# EAGLE design session 8 (EAGLE 9.6.2)
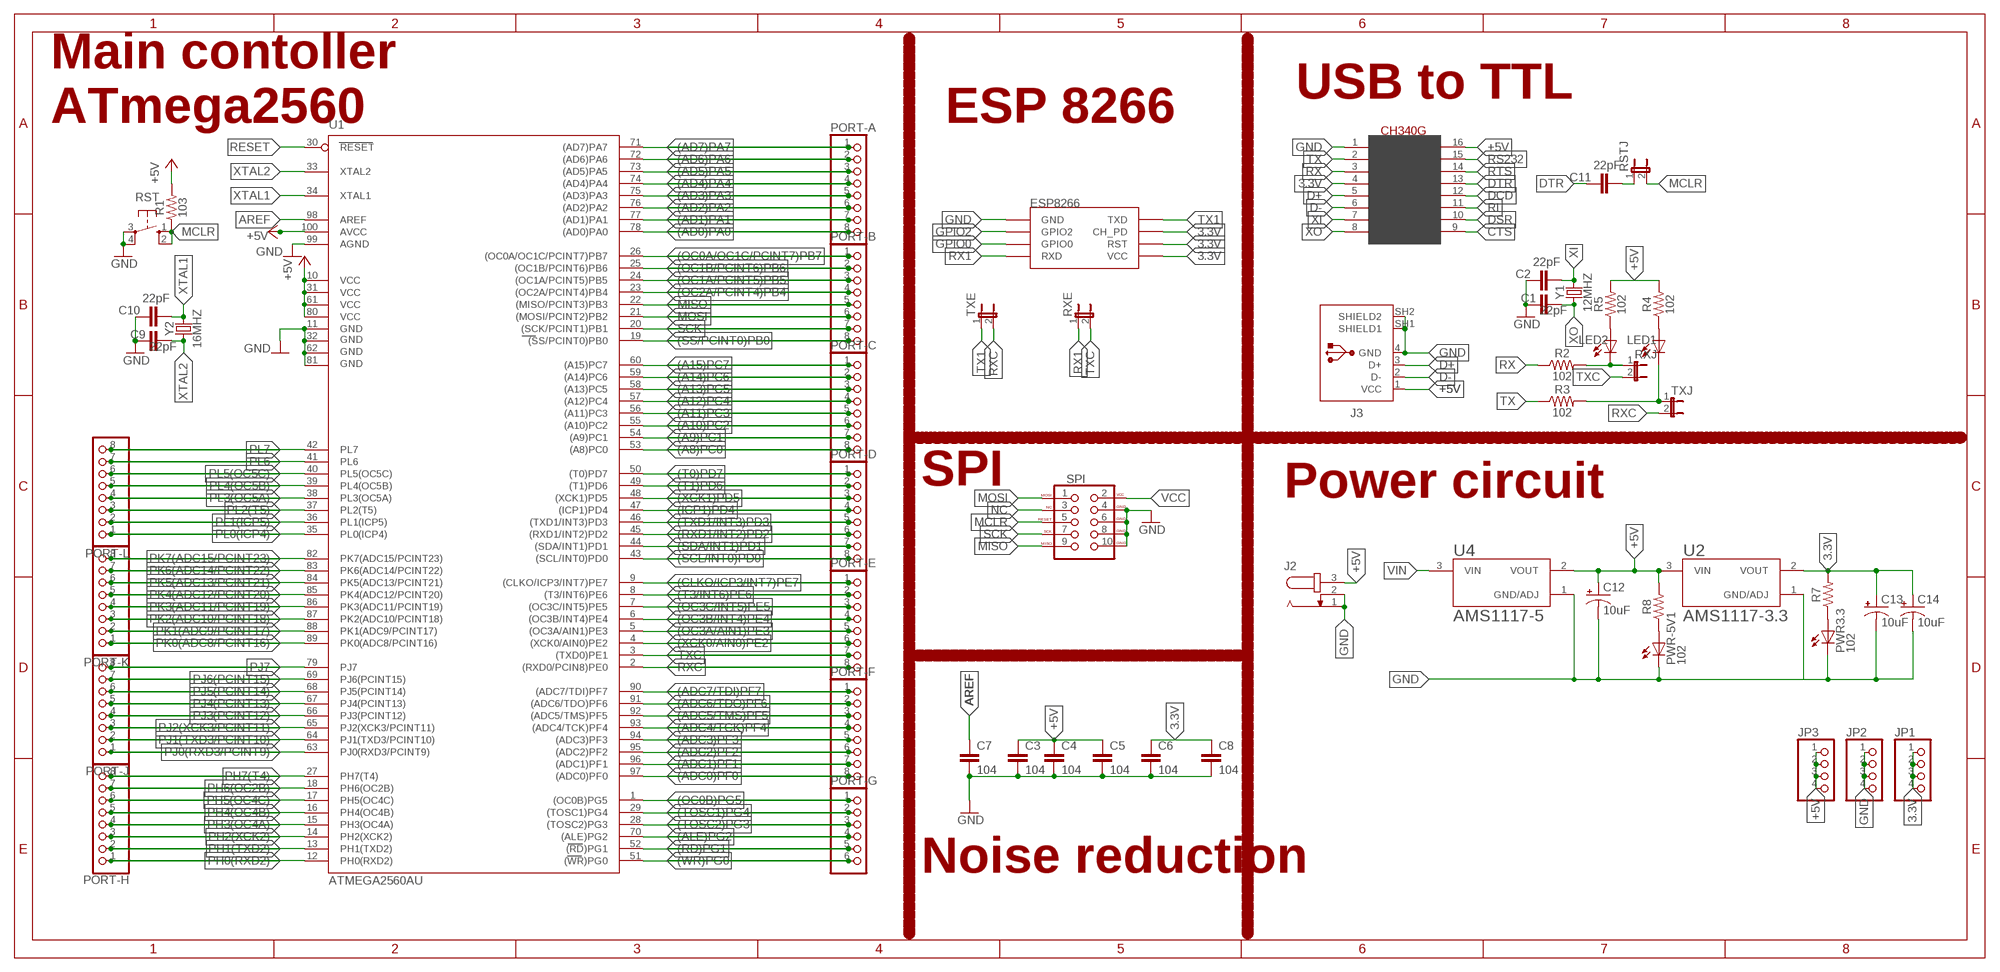
[diagram p0: schematic, sheet 1]

## Parts
C1  22pF  22PF-PTH-2.54MM-200V-5%  [CAP-PTH-2.54]
C2  22pF  22PF-PTH-2.54MM-200V-5%  [CAP-PTH-2.54]
C3  104  0.1UF-KIT-EZ-50V-20%  [CAP-PTH-SMALL-KIT]
C4  104  0.1UF-KIT-EZ-50V-20%  [CAP-PTH-SMALL-KIT]
C5  104  0.1UF-KIT-EZ-50V-20%  [CAP-PTH-SMALL-KIT]
C6  104  0.1UF-KIT-EZ-50V-20%  [CAP-PTH-SMALL-KIT]
C7  104  0.1UF-KIT-EZ-50V-20%  [CAP-PTH-SMALL-KIT]
C8  104  0.1UF-KIT-EZ-50V-20%  [CAP-PTH-SMALL-KIT]
C9  22pF  22PF-PTH-2.54MM-200V-5%  [CAP-PTH-2.54]
C10  22pF  22PF-PTH-2.54MM-200V-5%  [CAP-PTH-2.54]
C11  22pF  22PF-PTH-2.54MM-200V-5%  [CAP-PTH-2.54]
C12  10uF  10UF-POLAR-RADIAL-2.5MM-25V-20%  [CPOL-RADIAL-2.5MM-5MM]
C13  10uF  10UF-POLAR-RADIAL-2.5MM-25V-20%  [CPOL-RADIAL-2.5MM-5MM]
C14  10uF  10UF-POLAR-RADIAL-2.5MM-25V-20%  [CPOL-RADIAL-2.5MM-5MM]
ESP8266  ESP01  [ESP01]
J2  JACK-PLUG1  [SPC4078]
J3  61729-1011  [61729-1011BLF]
JP1  PINHD-1X4  [1X04]
JP2  PINHD-1X4  [1X04]
JP3  PINHD-1X4  [1X04]
LED1  LEDCHIP-LED0805  [CHIP-LED0805]
LED2  LEDCHIP-LED0805  [CHIP-LED0805]
PORT-A  PINHD-1X8  [1X08]
PORT-B  PINHD-1X8  [1X08]
PORT-C  PINHD-1X8  [1X08]
PORT-D  PINHD-1X8  [1X08]
PORT-E  PINHD-1X8  [1X08]
PORT-F  PINHD-1X8  [1X08]
PORT-G  PINHD-1X6  [1X06]
PORT-H  PINHD-1X8  [1X08]
PORT-J  PINHD-1X8  [1X08]
PORT-K  PINHD-1X8  [1X08]
PORT-L  PINHD-1X8  [1X08]
PWR3.3  102  LEDCHIP-LED0805  [CHIP-LED0805]
PWR-5V1  102  LEDCHIP-LED0805  [CHIP-LED0805]
R1  103  RESISTOR1206  [1206]
R2  102  RESISTOR1206  [1206]
R3  102  RESISTOR1206  [1206]
R4  102  RESISTOR1206  [1206]
R5  102  RESISTOR1206  [1206]
R7  RESISTOR1206  [1206]
R8  RESISTOR1206  [1206]
RST  10-XX  [B3F-10XX]
RSTJ  JP1E  [JP1]
RXE  JP1E  [JP1]
RXJ  JP1E  [JP1]
SPI  AVR_SPI_PROG_5X2LOCK  [2X5-SHROUDED_LOCK]
TXE  JP1E  [JP1]
TXJ  JP1E  [JP1]
U1  ATMEGA2560AU  [TQFP100]
U2  AMS1117-3.3  [SOT229P700X180-4N]
U4  AMS1117-5  AMS1117-3.3  [SOT229P700X180-4N]
U$2  CH340G  [SOIC16]
Y1  12MHZ  CRYSTALPTH-HC49UV  [HC49U]
Y2  16MHZ  CRYSTALPTH-HC49UV  [HC49U]

## Nets
3.3V: C6.1 C8.1 C13.1(+) C14.1(+) ESP8266.CH_PD ESP8266.RST ESP8266.VCC JP1.1 JP1.2 JP1.3 JP1.4 R7.2 U2.2(VOUT) U$2.4(V3)
(A8)PC0: PORT-C.8 U1.53((A8)PC0)
(A9)PC1: PORT-C.7 U1.54((A9)PC1)
(A10)PC2: PORT-C.6 U1.55((A10)PC2)
(A11)PC3: PORT-C.5 U1.56((A11)PC3)
(A12)PC4: PORT-C.4 U1.57((A12)PC4)
(A13)PC5: PORT-C.3 U1.58((A13)PC5)
(A14)PC6: PORT-C.2 U1.59((A14)PC6)
(A15)PC7: PORT-C.1 U1.60((A15)PC7)
(AD0)PA0: PORT-A.8 U1.78((AD0)PA0)
(AD1)PA1: PORT-A.7 U1.77((AD1)PA1)
(AD2)PA2: PORT-A.6 U1.76((AD2)PA2)
(AD3)PA3: PORT-A.5 U1.75((AD3)PA3)
(AD4)PA4: PORT-A.4 U1.74((AD4)PA4)
(AD5)PA5: PORT-A.3 U1.73((AD5)PA5)
(AD6)PA6: PORT-A.2 U1.72((AD6)PA6)
(AD7)PA7: PORT-A.1 U1.71((AD7)PA7)
(ADC0)PF0: PORT-F.8 U1.97((ADC0)PF0)
(ADC1)PF1: PORT-F.7 U1.96((ADC1)PF1)
(ADC2)PF2: PORT-F.6 U1.95((ADC2)PF2)
(ADC3)PF3: PORT-F.5 U1.94((ADC3)PF3)
(ADC4/TCK)PF4: PORT-F.4 U1.93((ADC4/TCK)PF4)
(ADC5/TMS)PF5: PORT-F.3 U1.92((ADC5/TMS)PF5)
(ADC6/TDO)PF6: PORT-F.2 U1.91((ADC6/TDO)PF6)
(ADC7/TDI)PF7: PORT-F.1 U1.90((ADC7/TDI)PF7)
(ALE)PG2: PORT-G.4 U1.70((ALE)PG2)
(CLKO/ICP3/INT7)PE7: PORT-E.1 U1.9((CLKO/ICP3/INT7)PE7)
(ICP1)PD4: PORT-D.4 U1.47((ICP1)PD4)
(OC0A/OC1C/PCINT7)PB7: PORT-B.1 U1.26((OC0A/OC1C/PCINT7)PB7)
(OC0B)PG5: PORT-G.1 U1.1((OC0B)PG5)
(OC1A/PCINT5)PB5: PORT-B.3 U1.24((OC1A/PCINT5)PB5)
(OC1B/PCINT6)PB6: PORT-B.2 U1.25((OC1B/PCINT6)PB6)
(OC2A/PCINT4)PB4: PORT-B.4 U1.23((OC2A/PCINT4)PB4)
(OC3A/AIN1)PE3: PORT-E.5 U1.5((OC3A/AIN1)PE3)
(OC3B/INT4)PE4: PORT-E.4 U1.6((OC3B/INT4)PE4)
(OC3C/INT5)PE5: PORT-E.3 U1.7((OC3C/INT5)PE5)
(RD)PG1: PORT-G.5 U1.52((RD)PG1)
(RXD1/INT2)PD2: PORT-D.6 U1.45((RXD1/INT2)PD2)
(SCL/INT0)PD0: PORT-D.8 U1.43((SCL/INT0)PD0)
(SDA/INT1)PD1: PORT-D.7 U1.44((SDA/INT1)PD1)
(SS/PCINT0)PB0: PORT-B.8 U1.19((SS/PCINT0)PB0)
(T0)PD7: PORT-D.1 U1.50((T0)PD7)
(T1)PD6: PORT-D.2 U1.49((T1)PD6)
(T3/INT6)PE6: PORT-E.2 U1.8((T3/INT6)PE6)
(TOSC1)PG4: PORT-G.2 U1.29((TOSC1)PG4)
(TOSC2)PG3: PORT-G.3 U1.28((TOSC2)PG3)
(TXD1/INT3)PD3: PORT-D.5 U1.46((TXD1/INT3)PD3)
(WR)PG0: PORT-G.6 U1.51((WR)PG0)
(XCK0/AIN0)PE2: PORT-E.6 U1.4((XCK0/AIN0)PE2)
(XCK1)PD5: PORT-D.3 U1.48((XCK1)PD5)
+5V: C3.1 C4.1 C5.1 C12.1(+) J2.3 J3.1(VCC) JP3.1 JP3.2 JP3.3 JP3.4 R1.2 R4.2 R5.2 R8.2 U1.10(VCC) U1.31(VCC1) U1.61(VCC2) U1.80(VCC3) U1.100(AVCC) U2.3(VIN) U4.2(VOUT) U$2.16(VCC)
AREF: C7.1 U1.98(AREF)
CTS: U$2.9(CTS)
D+: J3.3(D+) U$2.5(D+)
D-: J3.2(D-) U$2.6(D-)
DCD: U$2.12(DCD)
DSR: U$2.10(DSR)
DTR: C11.1 U$2.13(DTR)
GND: C1.1 C2.1 C3.2 C4.2 C5.2 C6.2 C7.2 C8.2 C9.1 C10.1 C12.2(-) C13.2(-) C14.2(-) ESP8266.GND J2.1 J2.2 J3.4(GND) J3.SH1(SHIELD1) J3.SH2(SHIELD2) JP2.1 JP2.2 JP2.3 JP2.4 PWR3.3.C PWR-5V1.C RST.3(P) RST.4(P1) SPI.4(GND) SPI.6(GND) SPI.8(GND) SPI.10(GND) U1.11(GND) U1.32(GND1) U1.62(GND2) U1.81(GND3) U1.99(AGND) U2.1(GND/ADJ) U4.1(GND/ADJ) U$2.1(GND)
GPIO0: ESP8266.GPIO0
GPIO2: ESP8266.GPIO2
MCLR: R1.1 RST.1(S) RST.2(S1) RSTJ.2 SPI.5(RESET)
MISO: PORT-B.5 SPI.9(MISO) U1.22((MISO/PCINT3)PB3)
MOSI: PORT-B.6 SPI.1(MOSI) U1.21((MOSI/PCINT2)PB2)
N$1: LED1.A R4.1
N$2: C11.2 RSTJ.1
N$3: LED2.A R5.1
N$5: PWR3.3.A R7.1
N$6: PWR-5V1.A R8.1
NC: SPI.3(NC)
PH0(RXD2): PORT-H.1 U1.12(PH0(RXD2))
PH1(TXD2): PORT-H.2 U1.13(PH1(TXD2))
PH2(XCK2): PORT-H.3 U1.14(PH2(XCK2))
PH3(OC4A): PORT-H.4 U1.15(PH3(OC4A))
PH4(OC4B): PORT-H.5 U1.16(PH4(OC4B))
PH5(OC4C): PORT-H.6 U1.17(PH5(OC4C))
PH6(OC2B): PORT-H.7 U1.18(PH6(OC2B))
PH7(T4): PORT-H.8 U1.27(PH7(T4))
PJ0(RXD3/PCINT9): PORT-J.1 U1.63(PJ0(RXD3/PCINT9))
PJ1(TXD3/PCINT10): PORT-J.2 U1.64(PJ1(TXD3/PCINT10))
PJ2(XCK3/PCINT11): PORT-J.3 U1.65(PJ2(XCK3/PCINT11))
PJ3(PCINT12): PORT-J.4 U1.66(PJ3(PCINT12))
PJ4(PCINT13): PORT-J.5 U1.67(PJ4(PCINT13))
PJ5(PCINT14): PORT-J.6 U1.68(PJ5(PCINT14))
PJ6(PCINT15): PORT-J.7 U1.69(PJ6(PCINT15))
PJ7: PORT-J.8 U1.79(PJ7)
PK0(ADC8/PCINT16): PORT-K.1 U1.89(PK0(ADC8/PCINT16))
PK1(ADC9/PCINT17): PORT-K.2 U1.88(PK1(ADC9/PCINT17))
PK2(ADC10/PCINT18): PORT-K.3 U1.87(PK2(ADC10/PCINT18))
PK3(ADC11/PCINT19): PORT-K.4 U1.86(PK3(ADC11/PCINT19))
PK4(ADC12/PCINT20): PORT-K.5 U1.85(PK4(ADC12/PCINT20))
PK5(ADC13/PCINT21): PORT-K.6 U1.84(PK5(ADC13/PCINT21))
PK6(ADC14/PCINT22): PORT-K.7 U1.83(PK6(ADC14/PCINT22))
PK7(ADC15/PCINT23): PORT-K.8 U1.82(PK7(ADC15/PCINT23))
PL0(ICP4): PORT-L.1 U1.35(PL0(ICP4))
PL1(ICP5): PORT-L.2 U1.36(PL1(ICP5))
PL2(T5): PORT-L.3 U1.37(PL2(T5))
PL3(OC5A): PORT-L.4 U1.38(PL3(OC5A))
PL4(OC5B): PORT-L.5 U1.39(PL4(OC5B))
PL5(OC5C): PORT-L.6 U1.40(PL5(OC5C))
PL6: PORT-L.7 U1.41(PL6)
PL7: PORT-L.8 U1.42(PL7)
RESET: U1.30(RESET)
RI: U$2.11(RI)
RS232: U$2.15(RS232)
RTS: U$2.14(RTS)
RX: R2.1 U$2.3(RX)
RX0: LED1.C R3.2 TXJ.1
RX1: ESP8266.RX(RXD) RXE.1
RXC: PORT-E.8 TXE.2 TXJ.2 U1.2((RXD0/PCIN8)PE0)
SCK: PORT-B.7 SPI.7(SCK) U1.20((SCK/PCINT1)PB1)
TX: R3.1 U$2.2(TX)
TX0: LED2.C R2.2 RXJ.1
TX1: ESP8266.TX(TXD) TXE.1
TXC: PORT-E.7 RXE.2 RXJ.2 U1.3((TXD0)PE1)
VCC: SPI.2(VCC)
VIN: U4.3(VIN)
XI: C2.2 U$2.7(XI) Y1.2
XO: C1.2 U$2.8(XO) Y1.1
XTAL1: C10.2 U1.34(XTAL1) Y2.2
XTAL2: C9.2 U1.33(XTAL2) Y2.1

## Notes on the sheet
- USB to TTL
- Main contoller 
  ATmega2560
- ESP 8266
- SPI | Power circuit
- Noise reduction

## Library data of the parts
C1 C2 C9-C11 = SparkFun-Capacitors:22PF: 22pF ceramic capacitors A capacitor is a passive two-terminal electrical component used to store electrical energy temporarily in an electric field.; PROD_ID: CAP-09128
C3-C8 = SparkFun-Capacitors:0.1UF: 0.1µF ceramic capacitors A capacitor is a passive two-terminal electrical component used to store electrical energy temporarily in an electric field.; PROD_ID: CAP-08370; VALUE: 0.1uF
C12-C14 = SparkFun-Capacitors:10UF-POLAR: 10.0µF polarized capacitors A capacitor is a passive two-terminal electrical component used to store electrical energy temporarily in an electric field.; PROD_ID: CAP-08440
ESP8266 = esp8266modules:ESP01: ESP8266 Wifi module 01
J2 = con-jack:JACK-PLUG: DC POWER JACK Power Jack, DC, Right Angle, Through Hole, Rated 5A at 16VDC, PC Terminals Distributor: Farnell (www.Farnell.de) Drawing: 84N1161.pdf / 84N1162.pdf Manufacturer: SPC Technology (www.spctechnology.com) Type: SPC4077 / SPC 4078; OC_FARNELL: unknown; OC_NEWARK: unknown
J3 = Connector_USB:61729-1011: USB(2.0) Type-B, RCPT, 4POS, THT-R/A Datasheet <https://www.amphenol-icc.com/media/wysiwyg/files/drawing/61729.pdf>; CATEGORY: Connector; CONTACTS: 4; CURRENT_RATING: 1A; DESCRIPTION: CONN RCPT USB2.0 TYPEB 4POS R/A; GENDER: Receptacle; MANUFACTURER: Amphenol ICC (FCI); MOUNT_TYPE: R/A; MPN: 61729-1011BLF; OPERATING_TEMP: -55°C to 85°C; PART_STATUS: Active; ROHS_COMPLIANT: RoHS Compliant; SERIES: 61729; SUB-CATEGORY: USB; TYPE: USB-B
JP1-JP3 = pinhead:PINHD-1X4: PIN HEADER
LED1 LED2 PWR3.3 PWR-5V1 = Fidget Spinner Example:LED: LED OSRAM: - CHIPLED LG R971, LG N971, LY N971, LG Q971, LY Q971, LO R971, LY R971 LH N974, LH R974 LS Q976, LO Q976, LY Q976 LO Q996 - Hyper CHIPLED LW Q18S LB Q993, LB Q99A, LB R99A - SideLED LS A670, LO A670, LY A670, LG A670, LP A670 LB A673, LV A673, LT A673, LW A673 LH A674 LY A675 LS A676, LA A676, LO A676, LY A676, LW A676 LS A679, LY A679, LG A679 - Hyper Micro SIDELED® LS Y876, LA Y876, LO Y876, LY Y876 LT Y87S - SmartLED LW L88C, LW L88S LB L89C, LB L89S, LG L890 LS L89K, LO L89K, LY L89K LS L896, LA L896, LO L896, LY L896 - TOPLED LS T670, LO T670, LY T670, LG T670, LP T670 LSG T670, LSP T670, LSY T670, LOP T670, LYG T670 LG T671, LOG T671, LSG T671 LB T673, LV T673, LT T673, LW T673 LH T674 LS T676, LA T676, LO T676, LY T676, LB T676, LH T676, LSB T676, LW T676 LB T67C, LV T67C, LT T67C, LS T67K, LO T67K, LY T67K, LW E67C LS E67B, LA E67B, LO E67B, LY E67B, LB E67C, LV E67C, LT E67C LW T67C LS T679, LY T679, LG T679 LS T770, LO T770, LY T770, LG T770, LP T770 LB T773, LV T773, LT T773, LW T773 LH T774 LS E675, LA E675, LY E675, LS T675 LS T776, LA T776, LO T776, LY T776, LB T776 LHGB T686 LT T68C, LB T68C - Hyper Mini TOPLED® LB M676 - Mini TOPLED Santana® LG M470 LS M47K, LO M47K, LY M47K Source: http://www.osram.convergy.de LUXEON: - LUMILED® LXK2-PW12-R00, LXK2-PW12-S00, LXK2-PW14-U00, LXK2-PW14-V00 LXK2-PM12-R00, LXK2-PM12-S00, LXK2-PM14-U00 LXK2-PE12-Q00, LXK2-PE12-R00, LXK2-PE12-S00, LXK2-PE14-T00, LXK2-PE14-U00 LXK2-PB12-K00, LXK2-PB12-L00, LXK2-PB12-M00, LXK2-PB14-N00, LXK2-PB14-P00, LXK2-PB14-Q00 LXK2-PR12-L00, LXK2-PR12-M00, LXK2-PR14-Q00, LXK2-PR14-R00 LXK2-PD12-Q00, LXK2-PD12-R00, LXK2-PD12-S00 LXK2-PH12-R00, LXK2-PH12-S00 LXK2-PL12-P00, LXK2-PL12-Q00, LXK2-PL12-R00 Source: www.luxeon.com KINGBRIGHT: KA-3528ASYC Source: www.kingbright.com
PORT-A PORT-B PORT-C PORT-D PORT-E PORT-F PORT-H PORT-J PORT-K PORT-L = pinhead:PINHD-1X8: PIN HEADER
PORT-G = pinhead:PINHD-1X6: PIN HEADER
R1-R5 R7 R8 = SparkFun-Resistors:RESISTOR: Generic Resistor Package
RST = switch-omron:10-XX: OMRON SWITCH; MPN: B3F-1000; OC_FARNELL: 176432; OC_NEWARK: 36M3542
RSTJ RXE RXJ TXE TXJ = jumper:JP1E: JUMPER
SPI = SparkFun-Connectors:AVR_SPI_PROG_5X2: AVR 10-pin ICSP Header This is the standard AVR In Circuit Serial Programming header. Minimal, but includes pin one indicator. Works with standard Olimex programmers. SparkFun Products: 2x5 AVR ICSP Male Header <https://www.sparkfun.com/products/778> - PTH 2x5 Pin Shrouded Header <https://www.sparkfun.com/products/8506> - PTH2; PROD_ID: CONN-08671; SF_ID: PRT-08506
U1 = SparkFun-IC-Microcontroller:ATMEGA2560: Atmel 100-pin 8-bit uC 64/128/256 Kbytes FLASH 4 Kbytes EEPROM 8 Kbytes SRAM 86 General Purpose I/O pins 12-channels16-bit PWM 4 x Serial USARTs 16-channels 10-bit A/D SparkFun Products None.; PROD_ID: IC-10040
U2 U4 = AMS1117-3.3:AMS1117-3.3: Check availability <https://pricing.snapeda.com/parts/AMS1117-3.3/Advanced%20Monolithic%20Systems/view-part?ref=eda>; AVAILABILITY: Not in stock; DESCRIPTION: Sot223/Pkg 1-Amp 3.3-Volt Low Drop Out Voltage Regulatator; MF: Advanced Monolithic Systems; MP: AMS1117-3.3; PACKAGE: SOT-223 Seeed Technology; PRICE: None
U$2 = CH340G (1):CH340G: Check availability <https://pricing.snapeda.com/parts/CH340G/Olimex/view-part?ref=eda>; AVAILABILITY: Not in stock; DESCRIPTION: IC-340 USB INTERFACE SO16; MF: Olimex; MP: CH340G; PACKAGE: None; PRICE: None
Y1 Y2 = SparkFun-Clocks:CRYSTAL: Crystals (Generic) These are passive quartz crystals, which can be used as a clock source for a microcontroller. Crystal's are two-terminal devices. They require external "load" capacitors to generate an oscillating signal.

## Board
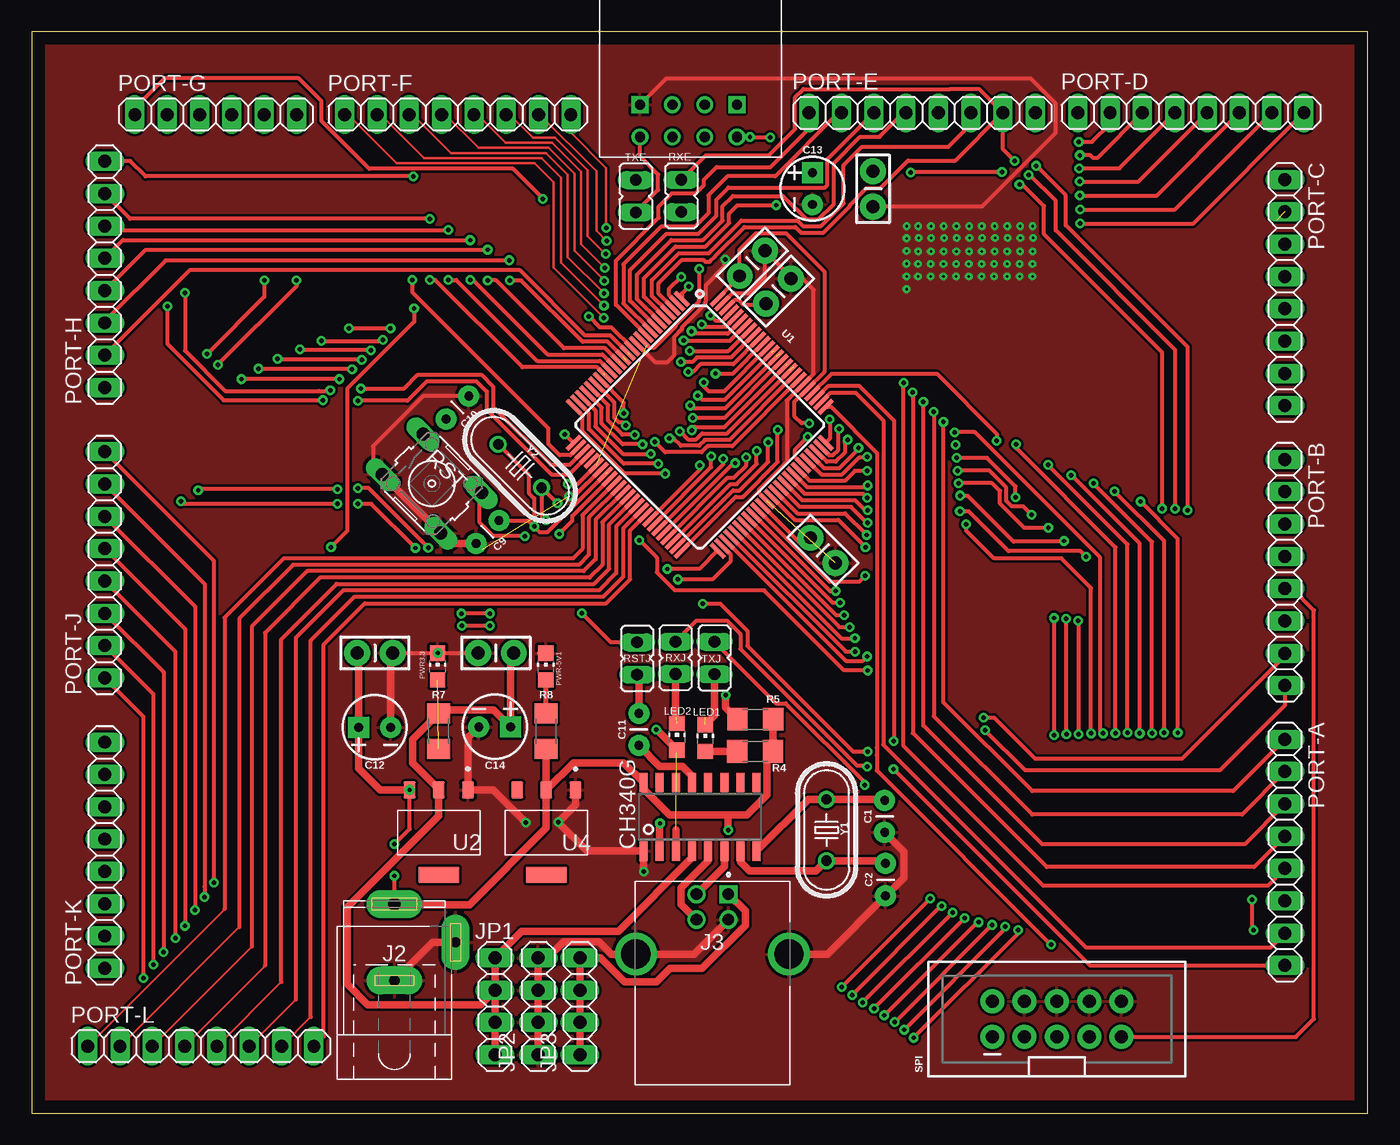
[diagram p1: board, top side]
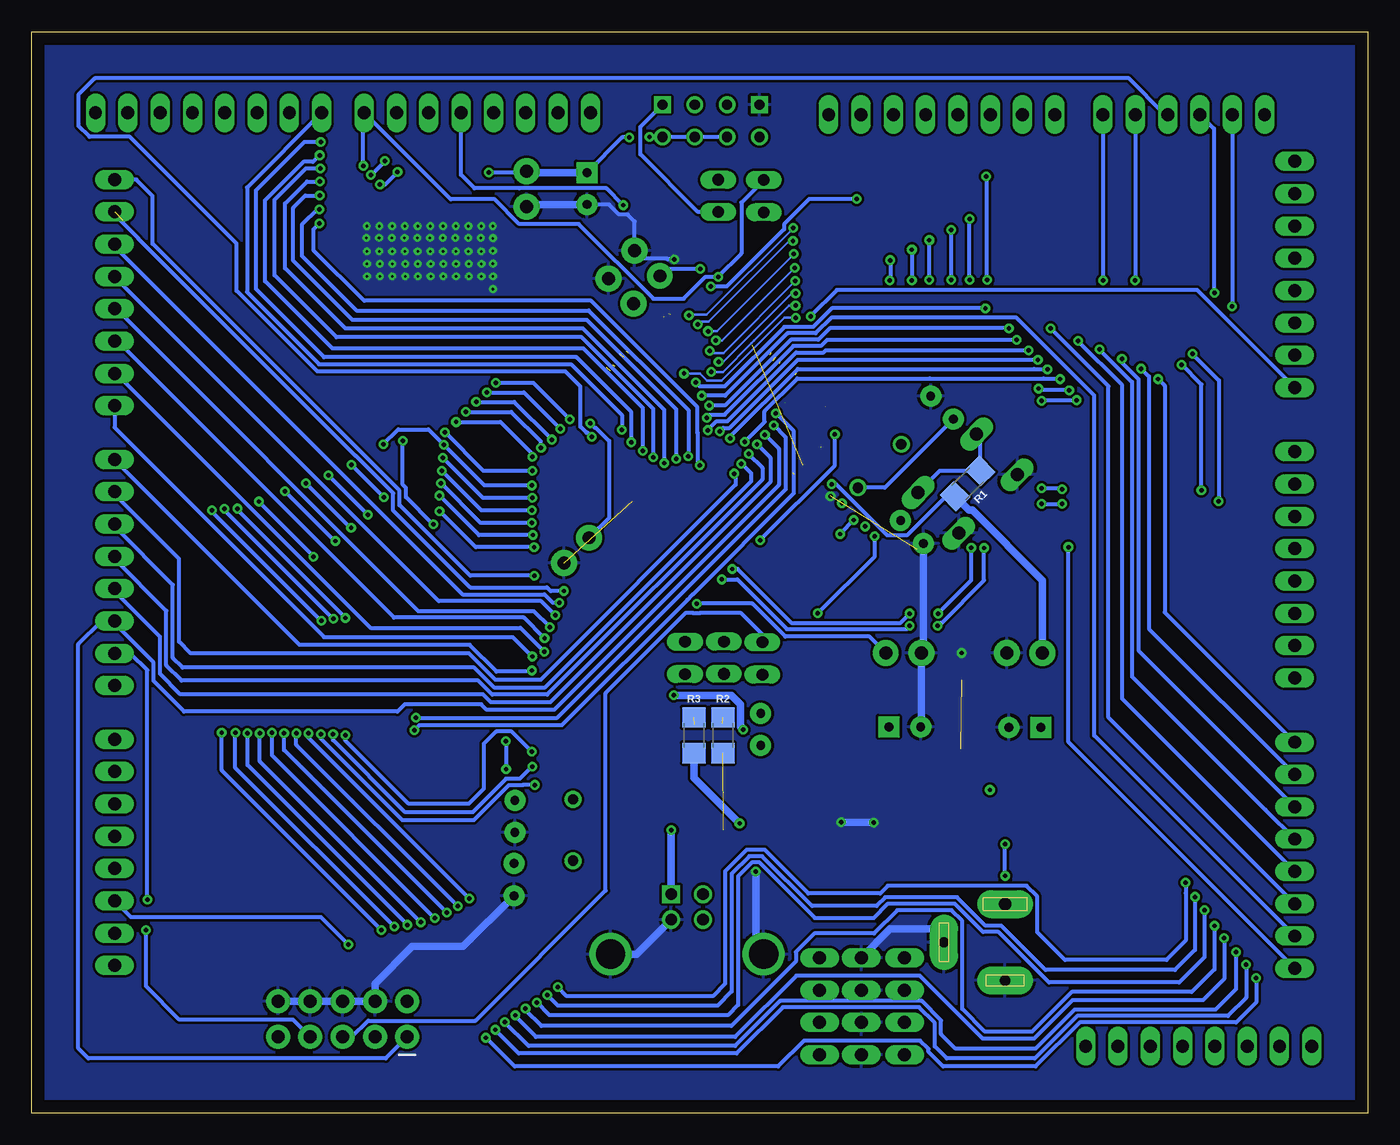
[diagram p2: board, bottom side, seen from below]

Size 105 x 85 mm. Coordinates in mm from the lower left corner, seen from the top.
Outline: 0,0 105,0 105,85 0,85 0,0
Copper layers (1*16): Top 0.035mm / dielectric 1.5mm / Bottom 0.035mm
Design rules "default *": minimum track width 0.2mm, minimum drill 0.2mm, track to track 0.2mm, track to pad 0.2mm, pad to pad 0.2mm, via to via 0.2mm, smd to smd 0.2mm, copper to edge 40mil, drill to drill 6mil, minimum pad ring 10mil, minimum via ring 8mil, stop-mask expansion 4mil, vias tented up to drill 0mil, thermal gap 10mil

### Footprints (pad centres in the part's own frame; a part is rotated, then mirrored left to right if it is on the bottom)
CAP-PTH-2.54 = drill 0.7 pad 1.651: 1 -1.27,0; 2 1.27,0
CAP-PTH-SMALL-KIT = drill 1.016 pad 2.032: 1 -1.397,0; 2 1.397,0
CPOL-RADIAL-2.5MM-5MM = drill 0.7 pad 1.651 square: 1 1.25,0 | drill 0.7 pad 1.651: 2 -1.25,0
ESP01 = drill 0.8: CH_PD -1.285,-8.178; GPIO0 1.255,-5.638; GPIO2 -1.285,-5.638; RST 1.255,-8.178; TX -3.825,-8.178; VCC 3.795,-8.178 | drill 0.8 square: GND -3.825,-5.638; RX 3.795,-5.638
SPC4078 = drill 0.8 pad 2.184 long: 1 -3,0; 2 0,-4.8 | drill 1 pad 2.184 long: 3 3,0
61729-1011BLF = drill 0.92 square: 1 1.25,4.71 | drill 0.92: 2 -1.25,4.71; 3 -1.25,2.71; 4 1.25,2.71 | drill 2.3: SH1 -6.02,0; SH2 6.02,0
1X04 = drill 1.016 long: 1 -3.81,0; 2 -1.27,0; 3 1.27,0; 4 3.81,0
CHIP-LED0805 = smd 1.2 x 1.2: A 0,-1.05; C 0,1.05
1X08 = drill 1.016 long: 1 -8.89,0; 2 -6.35,0; 3 -3.81,0; 4 -1.27,0; 5 1.27,0; 6 3.81,0; 7 6.35,0; 8 8.89,0
1X06 = drill 1.016 long: 1 -6.35,0; 2 -3.81,0; 3 -1.27,0; 4 1.27,0; 5 3.81,0; 6 6.35,0
1206 = smd 1.6 x 1.8: 1 -1.4,0; 2 1.4,0
B3F-10XX = drill 1.016 long: 1 -3.251,2.261; 2 3.251,2.261; 3 -3.251,-2.261; 4 3.251,-2.261
JP1 = drill 0.914 long: 1 0,-1.27; 2 0,1.27
2X5-SHROUDED_LOCK = drill 1.016 pad 1.88: 1 -1.397,5.08; 2 1.397,5.08; 3 -1.397,2.54; 4 1.397,2.54; 5 -1.397,0; 6 1.397,0; 7 -1.397,-2.54; 8 1.397,-2.54; 9 -1.397,-5.08; 10 1.397,-5.08
TQFP100 = smd 1.5 x 0.3: 1 -8,6; 2 -8,5.5; 3 -8,5; 4 -8,4.5; 5 -8,4; 6 -8,3.5; 7 -8,3; 8 -8,2.5; 9 -8,2; 10 -8,1.5; 11 -8,1; 12 -8,0.5; 13 -8,0; 14 -8,-0.5; 15 -8,-1; 16 -8,-1.5; 17 -8,-2; 18 -8,-2.5; 19 -8,-3; 20 -8,-3.5; 21 -8,-4; 22 -8,-4.5; 23 -8,-5; 24 -8,-5.5; 25 -8,-6; 51 8,-6; 52 8,-5.5; 53 8,-5; 54 8,-4.5; 55 8,-4; 56 8,-3.5; 57 8,-3; 58 8,-2.5; 59 8,-2; 60 8,-1.5; 61 8,-1; 62 8,-0.5; 63 8,0; 64 8,0.5; 65 8,1; 66 8,1.5; 67 8,2; 68 8,2.5; 69 8,3; 70 8,3.5; 71 8,4; 72 8,4.5; 73 8,5; 74 8,5.5; 75 8,6 | smd 0.3 x 1.5: 26 -6,-8; 27 -5.5,-8; 28 -5,-8; 29 -4.5,-8; 30 -4,-8; 31 -3.5,-8; 32 -3,-8; 33 -2.5,-8; 34 -2,-8; 35 -1.5,-8; 36 -1,-8; 37 -0.5,-8; 38 0,-8; 39 0.5,-8; 40 1,-8; 41 1.5,-8; 42 2,-8; 43 2.5,-8; 44 3,-8; 45 3.5,-8; 46 4,-8; 47 4.5,-8; 48 5,-8; 49 5.5,-8; 50 6,-8; 76 6,8; 77 5.5,8; 78 5,8; 79 4.5,8; 80 4,8; 81 3.5,8; 82 3,8; 83 2.5,8; 84 2,8; 85 1.5,8; 86 1,8; 87 0.5,8; 88 0,8; 89 -0.5,8; 90 -1,8; 91 -1.5,8; 92 -2,8; 93 -2.5,8; 94 -3,8; 95 -3.5,8; 96 -4,8; 97 -4.5,8; 98 -5,8; 99 -5.5,8; 100 -6,8
SOT229P700X180-4N = smd 1.31 x 0.93: 1 -3.345,2.29; 2 -3.345,0; 3 -3.345,-2.29 | smd 1.31 x 3.24: 4 3.345,0
SOIC16 = smd 0.635 x 1.524: 1 -4.445,-2.695; 2 -3.175,-2.695; 3 -1.905,-2.695; 4 -0.635,-2.695; 5 0.635,-2.695; 6 1.905,-2.695; 7 3.175,-2.695; 8 4.445,-2.695; 9 4.445,2.695; 10 3.175,2.695; 11 1.905,2.695; 12 0.635,2.695; 13 -0.635,2.695; 14 -1.905,2.695; 15 -3.175,2.695; 16 -4.445,2.695
HC49U = drill 0.813: 1 -2.413,0; 2 2.413,0

### Placement (x,y rotation side)
C1  67.03,23.33 90 top
C2  67.11,18.35 90 top
C3  62.18,44.24 315 top
C4  56.63,66.8 45 top
C5  26.96,36.17 0 top
C6  36.48,36.17 180 top
C7  58.68,64.61 45 top
C8  66.12,72.66 270 top
C9  35.81,45.68 45 top
C10  33.45,55.47 225 top
C11  47.71,30.16 90 top
C12  26.94,30.34 180 top
C13  61.36,72.68 90 top
C14  36.38,30.38 0 top
ESP8266  51.63,84.91 0 top
J2  28.5,13.43 90 top
J3  53.5,12.5 0 top
JP1  36.4,8.4 90 top
JP2  39.8,8.4 90 top
JP3  43.08,8.4 90 top
LED1  52.93,29.49 0 top
LED2  50.7,29.59 0 top
PORT-A  98.5,20.5 270 top
PORT-B  98.5,42.5 270 top
PORT-C  98.5,64.5 270 top
PORT-D  91.11,78.62 0 top
PORT-E  69.99,78.62 0 top
PORT-F  33.48,78.5 0 top
PORT-G  14.46,78.5 0 top
PORT-H  5.73,65.93 90 top
PORT-J  5.73,43.1 90 top
PORT-K  5.73,20.27 90 top
PORT-L  13.28,5.27 0 top
PWR3.3  31.89,35.1 0 top
PWR-5V1  40.4,35.1 0 top
R1  31.44,49.49 225 bottom
R2  50.69,29.71 90 bottom
R3  52.96,29.7 90 bottom
R4  56.85,28.44 0 top
R5  56.87,30.96 0 top
R7  31.98,30.02 90 top
R8  40.42,30.02 270 top
RST  31.44,49.49 315 top
RSTJ  47.58,35.74 0 top
RXE  51.05,72.1 0 top
RXJ  50.6,35.8 0 top
SPI  80.57,7.38 90 top
TXE  47.46,72.08 0 top
TXJ  53.66,35.78 0 top
U1  52.5,54.11 315 top
U2  31.98,22.07 270 top
U4  40.44,22.07 270 top
U$2  52.52,23.3 0 top
Y1  62.47,22.25 270 top
Y2  38.36,50.87 315 top

### Tracks (layer width: path | path; a pad name or v marks a point on that pad's centre or on a via)
3.3V  (via drill 0.35)
  Top 0.3: v56.45,76.72 58.02,76.72 v58.05,76.7 | v52.75,40.05 54.1,40.05 56.25,37.9 56.25,36.73 64.55,28.43 v65.7,28.43 | v80.36,29.7 80.36,38.91 v80.34,38.92 | v88.85,47.52 88.85,59.8 79.55,69.1 79.55,71.3 77.85,73 v77.62,73 | v76.25,73.97 69.1,73.97 v69.08,73.95
  Top 0.6: 51.89,20.09 U$2.4 51.89,20.09 46.1,14.3 38.49,14.3 JP1.4 JP1.3 | 31.95,25.38 U2.2 | U2.2 31.98,25.49 29.93,27.55 29.93,29.36 R7.2 32.26,31.7 36.31,31.7 C14.1 37.63,35.92 C6.1 | U2.2 31.98,23.39 24.77,16.18 24.77,10.15 26.4,8.53 35.26,8.53 JP1.3 | JP1.3 JP1.2 JP1.1
  Bottom 0.3: ESP8266.CH_PD ESP8266.RST ESP8266.VCC 56.44,76.73 v56.45,76.72 | v58.05,76.7 58.59,76.7 C13.1 | C6.1 39.16,37.45 45.77,37.45 48.38,40.05 v52.75,40.05 | v65.7,28.43 67.28,30 68.5,30 69.47,29.02 69.47,25.5 70.65,24.32 75.38,24.32 80.36,29.31 v80.36,29.7 | v80.34,38.92 88.85,47.43 v88.85,47.52 | v77.62,73 77.22,73 v76.25,73.97 | v69.08,73.95 66.02,73.95 66,73.93
  Bottom 0.6: C13.1 66,73.93 C8.1
(A8)PC0  (via drill 0.35)
  Top 0.3: v65.67,35.9 65.32,35.55 63.99,35.55 U1.53
  Bottom 0.3: PORT-C.8 98.5,53.9 82.03,37.43 67.75,37.43 67.58,37.43 67.2,37.43 v65.67,35.9
(A9)PC1  (via drill 0.35)
  Top 0.3: U1.54 63.97,36.27 v64.72,36.27
  Bottom 0.3: v64.72,36.27 66.6,38.15 78.37,38.15 98.37,58.15 PORT-C.7
(A10)PC2  (via drill 0.35)
  Top 0.3: U1.55 63.63,37.33 v64.7,37.33
  Bottom 0.3: v64.7,37.33 66.33,38.95 76.53,38.95 98.27,60.69 PORT-C.6
(A11)PC3  (via drill 0.35)
  Top 0.3: U1.56 63.46,38.2 64.15,38.2 v64.27,38.2
  Bottom 0.3: v64.27,38.2 65.53,39.45 74.6,39.45 98.38,63.23 PORT-C.5
(A12)PC4  (via drill 0.35)
  Top 0.3: U1.57 63.23,39.13 63.24,39.13 v63.85,39.13
  Bottom 0.3: 98.08,65.77 PORT-C.4 98.5,65.72 73.03,40.25 64.97,40.25 v63.85,39.13
(A13)PC5  (via drill 0.35)
  Top 0.3: U1.58 62.96,40.11 v63.52,40.11
  Bottom 0.3: v63.52,40.11 64.05,40.11 64.71,40.77 71.15,40.77 98.5,68.12 PORT-C.3
(A14)PC6  (via drill 0.35)  (1 unrouted)
  Top 0.3: v63.2,41.05 62.74,41.05 U1.59
  Bottom 0.3: v63.2,41.05 64.22,41.05 64.5,41.33 70.55,41.33 76.59,47.37 76.59,48.73 79.55,51.68 79.58,51.68 96.63,68.73 96.63,68.77 98.5,70.64 PORT-C.2 | 97.85,70.2 97.85,70.03
(A15)PC7  (via drill 0.35)
  Top 0.3: U1.60 58.39,46.1 | 58.39,46.1 | 58.39,46.1 62.7,41.79 65.04,41.79 v65.5,42.25
  Bottom 0.3: v65.5,42.25 70.55,42.25 76.09,47.79 76.09,48.93 95.5,68.34 95.5,72.1 96.79,73.39 PORT-C.1
(AD0)PA0  (via drill 0.35)
  Top 0.3: U1.78 62.63,57.17 65.03,57.17 67.78,54.42 67.78,29.27 v67.75,29.25 | v67.72,27.05 83.17,11.61 PORT-A.8
  Bottom 0.3: v67.75,29.25 67.72,29.23 v67.72,27.05
(AD1)PA1
  Top 0.3: U1.77 62.79,56.62 64.75,56.62 66.92,54.45 66.92,28.95 82.88,13 97.35,13 PORT-A.7
(AD2)PA2  (via drill 0.35)
  Top 0.3: U1.76 62.8,55.53 66.42,51.9 66.42,28.73 66.43,28.73 66.43,28.12 66.42,28.12 66.42,26.93 v80.11,13.24
  Bottom 0.3: v80.11,13.24 82.28,15.41 97.22,15.41 PORT-A.6
(AD3)PA3  (via drill 0.35)
  Top 0.3: PORT-A.5 97.15,17.88 79.5,17.88 68.53,28.85 v68.53,57.4 | 62.48,52.7 U1.75 62.73,53.02 v62.73,54.55
  Bottom 0.3: v62.73,54.55 65.58,57.4 v68.53,57.4
(AD4)PA4  (via drill 0.35)
  Top 0.3: U1.74 | PORT-A.4 96.08,19.34 79.78,19.34 69.25,29.88 v69.25,56.65 | U1.74 62.68,51.71 62.97,51.71 63.39,52.13 63.39,53.71 v63.48,53.8
  Bottom 0.3: v69.25,56.65 66.33,56.65 v63.48,53.8
(AD5)PA5  (via drill 0.35)
  Top 0.3: PORT-A.3 95.33,21.14 79.42,21.14 70.08,30.47 v70.08,55.9 | U1.73 | U1.73 62.48,51.2 63.17,51.2 63.9,51.92 63.9,52.72 v64.12,52.94
  Bottom 0.3: v70.08,55.9 67.08,55.9 v64.12,52.94
(AD6)PA6  (via drill 0.35)
  Top 0.3: PORT-A.2 95.12,23.48 78.62,23.48 70.9,31.2 v70.9,55.12 | U1.72 62.28,50.7 63.46,50.7 64.97,52.21 v64.97,52.29
  Bottom 0.3: v70.9,55.12 67.31,55.12 64.97,52.79 v64.97,52.29
(AD7)PA7  (via drill 0.35)
  Top 0.3: PORT-A.1 94.42,25.32 78.64,25.32 71.65,32.3 v71.65,54.33 | U1.71 62.07,50.2 63.69,50.2 65.02,51.53 65.6,51.53 v65.67,51.61
  Bottom 0.3: v71.65,54.33 68.17,54.33 65.67,51.83 v65.67,51.61
(ADC0)PF0  (via drill 0.35)  (1 unrouted)
  Top 0.2: PORT-F.8 42.37,77.06 45.15,74.28 v45.15,69.58 | 54.84,62.81 54.9,62.81
  Top 0.3: 54.55,62.52 54.84,62.81 U1.97 | 54.78,62.76 54.34,62.32 53.73,62.32 v53.34,62.7
  Bottom 0.2: v53.34,62.7 53.28,62.77 51.96,62.77 v45.15,69.58
(ADC1)PF1  (via drill 0.35)  (1 unrouted)
  Top 0.2: v45.17,68.56 44.38,69.36 44.38,74.05 39.92,78.5 PORT-F.7
  Top 0.3: 55.35,62.62 U1.96 54.55,61.82 54.53,61.8 52.87,61.8 v52.66,62.01
  Bottom 0.2: v45.17,68.56 45.48,68.56 51.8,62.24 52.44,62.24 v52.66,62.01
(ADC2)PF2  (via drill 0.35)
  Top 0.2: v45.1,67.53 43.67,68.96 43.67,74.12 41.12,76.68 39.38,76.68 37.56,78.5 PORT-F.6
  Top 0.3: U1.95 54.71,61.27 52.05,61.27 v51.85,61.47
  Bottom 0.2: v45.1,67.53 51.16,61.47 v51.85,61.47
(ADC3)PF3  (via drill 0.35)
  Top 0.2: v45.02,66.45 45.02,66.47 43.17,68.32 43.17,74 40.9,76.28 37.24,76.28 35.02,78.5 PORT-F.5
  Top 0.3: U1.94 54.84,60.7 54.81,60.7 54.83,60.69 51.27,60.69 v51.23,60.74
  Bottom 0.2: v45.02,66.45 45.03,66.45 50.74,60.74 v51.23,60.74
(ADC4/TCK)PF4  (via drill 0.35)
  Top 0.2: v45,65.42 45,65.44 42.65,67.79 42.65,73.85 40.62,75.88 35.1,75.88 32.48,78.5 PORT-F.4
  Top 0.3: v51.7,59.91 54.76,59.91 U1.93
  Bottom 0.2: v45,65.42 45,65.41 50.65,59.76 51.55,59.76 v51.7,59.91
(ADC5/TMS)PF5  (via drill 0.35)
  Top 0.2: v44.98,64.45 42.12,67.3 42.12,73.78 40.42,75.48 32.97,75.48 29.94,78.5 PORT-F.3
  Top 0.3: v51.02,59.05 51.92,59.05 52.27,59.4 54.96,59.4 U1.92
  Bottom 0.2: v44.98,64.45 45.27,64.45 50.66,59.05 v51.02,59.05
(ADC6/TDO)PF6  (via drill 0.35)
  Top 0.2: v44.98,63.48 v44.98,63.49 41.6,66.87 41.6,73.53 40.05,75.08 30.82,75.08 27.4,78.5 PORT-F.2
  Top 0.3: v51.6,58.27 51.95,58.27 52.55,58.87 55.14,58.87 U1.91
  Bottom 0.2: v44.98,63.48 45.48,63.48 48.24,60.72 48.43,60.53 50.69,58.27 v51.6,58.27
(ADC7/TDI)PF7  (via drill 0.35)
  Top 0.2: v44.95,62.52 41,66.47 41,73.17 39.5,74.68 28.68,74.68 24.86,78.5 PORT-F.1
  Top 0.3: v53.74,58.14 55.11,58.14 U1.90
  Bottom 0.2: v44.95,62.52 45.85,62.52 50.78,57.59 51.93,57.59 52.48,58.14 v53.74,58.14
(ALE)PG2  (via drill 0.35)
  Top 0.3: U1.70 | U1.70 60,51.56 60,52.17 v60.97,53.15
  Bottom 0.3: PORT-G.4 15.93,78.5 18.76,81.33 100.05,81.33 101.33,80.05 101.33,77.63 100.46,76.75 97.3,76.75 88.9,68.35 88.9,64.65 82.55,58.3 63.05,58.3 61.87,57.12 61.87,53.97 61.4,53.5 61.32,53.5 v60.97,53.15
(CLKO/ICP3/INT7)PE7
  Top 0.3: PORT-E.1 61.1,77.4 58.08,74.38 53.83,74.38 52.82,73.37 52.82,72.93 52.2,72.31 50.32,72.31 49.28,71.27 49.28,70.38 45.9,67 45.9,63.54 U1.9
(ICP1)PD4  (via drill 0.35)
  Top 0.3: U1.47 54.7,49.95 55.19,49.95 56.16,50.92 v56.16,51.56 | PORT-D.4 85.48,74.28 v82.33,74.28
  Bottom 0.3: v56.16,51.56 56.16,55.38 61.77,61 81.05,61 85.92,65.87 85.92,71.8 83.44,74.28 v82.33,74.28
(OC0A/OC1C/PCINT7)PB7  (via drill 0.35)
  Top 0.3: v47.76,45.03 49.13,43.66 49.13,42.51 50.55,41.09 57.56,41.09 63.85,34.8 v65.7,34.8 | U1.26 42.55,52.7 v41.88,53.38
  Bottom 0.3: PORT-B.1 98.5,51.34 83.96,36.8 70.59,36.8 68.48,34.7 65.8,34.7 v65.7,34.8 | v47.76,45.03 41.88,50.92 v41.88,53.38
(OC0B)PG5  (via drill 0.35)
  Top 0.3: v51.62,64.97 51.09,64.44 U1.1 | PORT-G.1 8.11,78.99 10.45,81.33 20.97,81.33 22.77,79.53 22.77,77.97 26.52,74.22 37.83,74.22 v40.17,71.88
  Bottom 0.3: v40.17,71.88 40.17,71.85 43.9,71.85 45.88,69.88 45.88,69.48 50.39,64.97 v51.62,64.97
(OC1A/PCINT5)PB5  (via drill 0.35)
  Top 0.3: v49.23,51.05 v49.22,51.04 46.52,51.04 43.8,53.77 43.8,55.04 U1.24
  Bottom 0.3: v49.23,51.05 48.45,50.28 48.45,49.67 64.65,33.48 68.67,33.48 70.22,35.02 93.15,35.02 93.92,35.8 93.92,41.53 98.5,46.1 PORT-B.3
(OC1B/PCINT6)PB6  (via drill 0.35)  (1 unrouted)
  Top 0.3: U1.25 43.3,54.83 43.3,53.56 46.59,50.27 v49.77,50.27
  Bottom 0.3: v49.77,50.27 49.67,50.17 49.67,49.4 65.01,34.07 68.56,34.07 70.64,36.15 92.5,36.15 93.42,37.08 93.42,43.57 98.5,48.65 PORT-B.2
(OC2A/PCINT4)PB4  (via drill 0.35)
  Top 0.3: v48.65,51.82 | v48.65,51.82 46.45,51.82 44.3,53.98 44.3,55.24 U1.23 | U1.23
  Bottom 0.3: v48.65,51.82 47.58,50.75 47.58,49.82 64.5,32.9 68.81,32.9 69.91,34 93.22,34 94.42,35.2 94.42,39.49 98.5,43.56 PORT-B.4
(OC3A/AIN1)PE3  (via drill 0.35)
  Top 0.3: U1.5 48.1,64.17 48.1,65.62 50.6,68.12 52.96,68.12 54.8,69.97 54.8,70.72 55.45,71.37 v58.52,71.37
  Bottom 0.3: v58.52,71.37 59.84,72.69 66.69,72.69 66.7,72.7 70.2,72.7 71.26,73.76 PORT-E.5
(OC3B/INT4)PE4
  Top 0.3: U1.6 | U1.6 47.56,64 47.56,65.91 50.27,68.62 52.75,68.62 54.3,70.17 54.3,71.3 55.1,72.1 59.03,72.1 60.87,70.25 61.85,70.25 63.03,71.44 63.03,74.69 65.1,76.75 66.64,76.75 68.52,78.62 PORT-E.4
(OC3C/INT5)PE5
  Top 0.3: U1.7 47,63.85 47,66.25 49.88,69.12 52.39,69.12 53.8,70.53 53.8,71.8 54.76,72.75 62.33,72.75 62.53,72.96 62.53,74.98 PORT-E.3
(RD)PG1  (via drill 0.35)
  Top 0.3: U1.52 54.9,43.93 54.9,43.35 53.5,41.95 v50.77,41.95 | v36,38.3 33.82,38.3 v33.8,38.32 | v30.15,44.42 26.68,47.9 v25.62,47.9 | v18.27,65.45 18.27,64.17 v13.78,59.67 | v24.02,47.9 11.93,47.9 v11.72,48.1
  Bottom 0.3: v50.77,41.95 49.55,41.95 45.65,38.05 36.25,38.05 v36,38.3 | v33.8,38.32 33.57,38.55 33.47,38.55 30.15,41.87 v30.15,44.42 | v25.62,47.9 v24.02,47.9 | PORT-G.5 18.27,65.46 v18.27,65.45 | v13.78,59.67 11.7,57.6 11.7,48.12 v11.72,48.1
(RXD1/INT2)PD2  (via drill 0.35)
  Top 0.3: U1.45 54.36,51.02 v54.36,51.42 | PORT-D.6 88.42,72.12 v82.38,72.12
  Bottom 0.3: v54.36,51.42 54.34,51.45 54.34,55.32 61.37,62.35 79.8,62.35 84.45,67 84.45,71.17 83.5,72.12 v82.38,72.12
(SCL/INT0)PD0  (via drill 0.35)
  Top 0.3: U1.43 52.5,50.58 v52.5,50.92 | v82.4,69.92 91.3,69.92 PORT-D.8
  Bottom 0.3: v82.4,69.92 82.88,69.45 82.88,67.85 78.88,63.85 61.04,63.85 52.68,55.48 52.68,53.47 52.67,53.46 52.67,51.1 v52.5,50.92
(SDA/INT1)PD1  (via drill 0.35)
  Top 0.3: U1.44 53.4,50.77 v53.4,51.63 | v82.4,71.05 82.42,71.03 89.86,71.03 PORT-D.7
  Bottom 0.3: v82.4,71.05 82.55,71.05 83.78,69.83 83.78,67.4 79.47,63.1 61.23,63.1 53.4,55.28 v53.4,51.63
(SS/PCINT0)PB0  (via drill 0.35)
  Top 0.3: PORT-B.8 98.5,32.06 93.39,26.95 78.08,26.95 v74.92,30.1 | v46.52,55.02 46.52,55.84 U1.19
  Bottom 0.3: v74.92,30.1 74.53,30.5 63.33,30.5 53.48,40.35 53.05,40.78 45.1,48.73 45.1,53.6 v46.52,55.02
(T0)PD7  (via drill 0.35)
  Top 0.3: U1.50 55.32,48.45 55.88,48.45 58.62,51.19 v58.62,53.7
  Bottom 0.3: v58.62,53.7 58.62,54.88 62.62,58.88 82.42,58.88 88.09,64.55 88.09,72.75 PORT-D.1
(T1)PD6  (via drill 0.35)
  Top 0.3: U1.49 55.11,48.95 55.62,48.95 57.88,51.2 v57.88,52.75 | v82.3,76.36 83.32,76.36 84.75,77.79 PORT-D.2
  Bottom 0.3: v57.88,52.75 57.88,55.1 62.2,59.42 82.03,59.42 87.38,64.78 87.38,72.55 83.57,76.36 v82.3,76.36
(T3/INT6)PE6
  Top 0.3: PORT-E.2 63.41,78.62 58.44,73.65 54.67,73.65 53.17,72.15 53.17,70.74 52.11,69.67 49.45,69.67 46.5,66.72 46.5,63.65 U1.8
(TOSC1)PG4  (via drill 0.35)
  Top 0.3: v10.65,63.42 10.65,60.48 15.07,56.05 v22.88,56.05 | v25.62,56 29.52,56 31.07,57.54 34.94,57.54 35.75,56.73 35.75,55.32 40.87,50.2 42.22,50.2 U1.29
  Bottom 0.3: PORT-G.2 v10.64,63.43 v10.65,63.42 | v25.62,56 25.57,56.05 v22.88,56.05
(TOSC2)PG3  (via drill 0.35)
  Top 0.3: v12.05,64.47 12.05,59.92 15.2,56.77 22.57,56.77 22.57,56.78 23.4,56.78 v23.45,56.83 | v25.88,56.96 29.26,56.96 30.34,58.04 35.33,58.04 36.27,57.1 36.27,55.5 40.8,50.98 42.29,50.98 U1.28
  Bottom 0.3: PORT-G.3 12.09,77.4 12.09,64.51 v12.05,64.47 | v23.45,56.83 25.75,56.83 v25.88,56.96
(TXD1/INT3)PD3  (via drill 0.35)
  Top 0.3: U1.46 55.12,51.08 55.26,51.08 v55.28,51.1 | PORT-D.5 86.97,73.22 v82.35,73.22
  Bottom 0.3: v55.28,51.1 55.28,55.28 61.67,61.67 80.35,61.67 85.1,66.42 85.1,71.5 83.37,73.22 v82.35,73.22
(WR)PG0  (via drill 0.35)
  Top 0.3: U1.51 52.48,42.77 v49.95,42.77 | v36,39.27 v33.77,39.27 | v31.15,44.45 30.88,44.72 30.88,44.73 26.48,49.12 v25.62,49.12 | v20.8,65.45 20.8,65 v14.62,58.83 | v24.02,49.05 13.18,49.05 v13.07,48.95
  Bottom 0.3: v49.95,42.77 49.52,42.77 45.3,38.55 36.73,38.55 v36,39.27 | v33.77,39.27 31.15,41.9 v31.15,44.45 | v25.62,49.12 24.1,49.12 v24.02,49.05 | PORT-G.6 v20.8,65.45 | v14.62,58.83 13.07,57.27 v13.07,48.95
(XCK0/AIN0)PE2
  Top 0.3: U1.4 48.74,64.23 48.74,65.48 50.86,67.6 53.21,67.6 55.77,70.16 60.17,70.16 60.6,69.72 62.02,69.72 63.8,71.5 63.8,74.5 65.25,75.95 72.03,75.95 73.8,77.72 PORT-E.6
(XCK1)PD5  (via drill 0.35)
  Top 0.3: U1.48 54.91,49.45 55.39,49.45 56.98,51.03 v56.98,52.08 | PORT-D.3 83.75,75.08 83.42,75.08 83.2,75.3 v82.38,75.3
  Bottom 0.3: v56.98,52.08 56.98,55.42 61.65,60.1 81.38,60.1 86.67,65.4 86.67,71.75 83.65,74.78 82.9,74.78 v82.38,75.3
+5V  (via drill 0.35)  (2 unrouted)
  Top 0.3: U1.100 55.64,65.74 C4.1 55.64,67.89 56.91,69.16 59.29,69.16 62.3,66.15 62.3,58.26 U1.80 59.92,55.88 59.92,54.8 60.5,54.23 v61.1,54.23 | J2.3 v28.5,18.65 | v28.49,21.13 29.7,22.34 U2.3 | U1.61 58.6,46.6 60.52,44.67 60.64,44.67 C3.1 | U1.31 42.89,49.45 v42.14,49.45 | 48.37,60.37 U1.10 48.54,60.2 48.95,60.2 50.62,61.87 50.62,61.98 52.43,63.78 52.43,63.94 52.48,63.99 v52.48,66.35
  Top 0.4: 40.42,25.42 U4.2
  Top 0.6: J3.1 56.08,15.88 56.08,14.78 52.67,11.38 52.48,11.38 52.46,11.39 50.16,11.39 49.1,10.32 49.08,10.34 46.59,10.34 44.72,12.21 JP3.4 JP3.3 JP3.2 JP3.1 | C5.1 25.69,36.05 C12.1 25.69,27.09 27.36,25.41 U2.3 | R5.2 58.27,28.46 R4.2 57.79,27.98 57.79,25.03 56.21,23.45 54.65,23.45 | U4.2 40.44,28.61 R8.2 | U4.2 40.44,22.41 34.4,16.38 28.55,16.38 J2.3 | 54.65,23.45 50.11,23.45 48.08,25.48 U$2.16 46.52,27.55 42.58,27.55 U4.2 | v54.73,22.25 54.73,23.38 54.65,23.45
  Bottom 0.3: C3.1 59.62,46.8 59.62,52.83 60.67,53.88 60.75,53.88 v61.1,54.23 | v28.5,18.65 v28.5,21.12 v28.49,21.13 | R1.2 33.13,48.5 36.22,45.41 37.75,45.41 41.79,49.45 v42.14,49.45 | v52.48,66.35 55.11,66.35 C4.1
  Bottom 0.6: J3.1 54.75,22.23 v54.73,22.25 | R1.2 31.33,47.39 31.08,47.39 25.57,41.88 C5.1
  other vias: 29.7,25.41 28.5,16.43
AREF
  Top 0.3: U1.98 | U1.98 55.25,63.94 55.54,63.94 55.91,63.56 57.64,63.56 C7.1
D+
  Top 0.6: U$2.5 53.16,19.84 51.04,17.71 51.04,16.42 J3.3
D-
  Top 0.6: J3.2 54.43,19.39 U$2.6
DTR
  Top 0.6: C11.1 49.34,27.26 51.15,27.26 51.86,26.54 51.86,26.02 U$2.13
GND  (via drill 0.2 pad 0.3, 0.35)  (2 unrouted)
  Top 0.2: U1.99 54.29,63.66
  Top 0.3: U1.62 | C6.2 v31.91,36.17 PWR3.3.C 31.87,36.17 C5.2 | U1.62 57.17,48.73 57.17,49.02 59.35,51.21 59.35,56.02 U1.81 61.45,58.11 61.45,64.72 60.57,65.6 C7.2 59.67,65.74 C4.2 57.62,65.72 56.35,64.45 55.06,64.45 U1.99 | 35.39,44.31 C9.1 35.25,44.45 | U1.32 | C10.1 30.77,56.37 26.82,52.42 26.82,50.91 27.77,49.97 | ESP8266.GND 49.87,81.33 78.51,81.33 80.45,79.39 80.45,77.02 74.69,71.26 C8.2 | U1.11 | U1.11 48.6,59.42 48.98,59.05 49.95,59.05 50.5,59.6 50.5,61.04 51.12,61.67 51.12,61.77 52.93,63.58 52.93,63.73 52.98,63.78 52.98,65.08 54.5,66.61 v54.5,67.12 | U1.32 42.64,48.49 v42.23,48.49 | 60.38,57.04
  Top 0.4: PWR-5V1.C 39.91,36.15
  Top 0.6: J2.1 31.5,13.43 J2.2 33.3,12.76 | J3.4 52.04,12.5 J3.SH1 45.56,12.5 44.59,13.47 41.79,13.47 40.53,12.21 JP2.4 JP2.3 JP2.2 JP2.1 | J3.SH2 62.53,12.5 C2.1 67.13,17.08 68.55,18.5 68.55,20.55 C1.1 | C14.2 34.27,29.52 U2.1 36.27,25.41 v38.83,22.85 | C12.2 28.19,36 C5.2 | U4.1 42.73,24.23 v41.38,22.88 43.65,20.61 U$2.1 48.08,19 v48.1,18.98 | RST.3 27.77,49.97 RST.4 32.95,44.79 C9.1
  Bottom 0.3: C13.2 59.61,71.43 58.83,70.64 58.17,70.64 57.62,70.09 C4.2 57.01,67.18 55.07,67.18 55.02,67.12 v54.5,67.12
  Bottom 0.6: C14.2 35.09,30.42 C6.2 34.91,36.35 C9.1 | v38.83,22.85 41.35,22.85 v41.38,22.88 | v48.1,18.98 48.1,13.12 J3.SH1 | JP2.4 37.54,14.47 34.35,14.47 J2.2 | J3.4 57.46,12.5 J3.SH2 | C2.1 71.09,13.1 75.1,13.1 78.03,10.17 SPI.4 SPI.6 SPI.8 SPI.10 | C13.2 65.96,71.43 C8.2
  other vias: 68.78,69.72 69.67,69.72 70.67,69.72 71.67,69.72 72.67,69.72 73.67,69.72 74.67,69.72 75.67,69.72 76.67,69.72 77.67,69.72 78.67,69.72 68.75,68.78 68.75,67.78 68.75,66.78 68.75,65.78 68.75,64.78 69.7,68.8 70.7,68.8 71.7,68.8 72.7,68.8 73.7,68.8 74.7,68.8 75.7,68.8 76.7,68.8 77.7,68.8 78.7,68.8 69.67,67.75 70.67,67.75 71.67,67.75 72.67,67.75 73.67,67.75 74.67,67.75 75.67,67.75 76.67,67.75 77.67,67.75 78.67,67.75 69.65,66.75 70.65,66.75 71.65,66.75 72.65,66.75 73.65,66.75 74.65,66.75 75.65,66.75 76.65,66.75 77.65,66.75 78.65,66.75 69.65,65.78 70.65,65.78 71.65,65.78 72.65,65.78 73.65,65.78 74.65,65.78 75.65,65.78 76.65,65.78 77.65,65.78 78.65,65.78
  pour Top: 0,85 105,85 105,0 0,0
  pour Bottom: 0,85 105,85 105,0 0,0
MCLR  (via drill 0.35)
  Top 0.3: RSTJ.2 45.51,37.02 v43.23,39.3 | v38.75,45.35 36.27,45.35 35.2,46.42 35.2,48.65 RST.2
  Bottom 0.3: SPI.5 79.85,5.99 78.56,7.28 70.12,7.28 59.9,17.5 59.9,33.03 53.58,39.35 53.08,39.35 53.05,39.32 52.45,39.32 52.42,39.35 49.3,39.35 47.58,37.62 RSTJ.2 | RST.2 33.65,50.48 R1.1 30.45,53.1 RST.1 | v43.23,39.3 38.75,43.77 v38.75,45.35
MISO  (via drill 0.35)
  Top 0.2: 44.8,55.45
  Top 0.3: SPI.9 99.36,5.99 100.78,7.4 100.78,39.52 99.07,41.23 PORT-B.5 | v48,52.58 46.43,52.58 44.8,54.21 44.8,55.45 U1.22 | U1.22
  Bottom 0.3: v48,52.58 46.95,51.52 46.95,49.6 64.25,32.3 68.91,32.3 69.54,32.92 93.33,32.92 94.92,34.52 94.92,37.45 98.5,41.02 PORT-B.5
MOSI  (via drill 0.35)
  Top 0.3: U1.21 45.3,55.66 45.3,54.44 46.41,53.33 v47.38,53.33
  Bottom 0.3: SPI.1 77.18,4.3 100.55,4.3 101.33,5.08 101.33,36.88 99.52,38.69 98.58,38.69 | 98.58,38.69 PORT-B.6 | v47.38,53.33 46.27,52.22 46.27,49.38 63.95,31.7 69.25,31.7 69.68,32.13 75.7,32.13 76.25,31.57 93.03,31.57 95.42,33.98 95.42,35.41 98.58,38.56 98.58,38.69
N$1
  Top 0.6: LED1.A R4.1
N$2
  Top 0.6: C11.2 47.71,34.34 RSTJ.1
N$3  (via drill 0.35)
  Top 0.6: LED2.A v49.09,30.15 v49.08,30.15 | v54.54,32.85 54.54,31.9 R5.1
  Bottom 0.6: v49.08,30.15 49.28,30.36 49.28,32.12 50.02,32.85 v54.54,32.85
N$5  (1 unrouted)
N$6
  Top 0.4: R8.1 40.42,34.02 PWR-5V1.A
PH0(RXD2)  (via drill 0.35)
  Top 0.3: v43.79,62.64 44.64,61.78 45.53,61.78 U1.12
  Bottom 0.3: v43.79,62.64 41.72,64.7 13.39,64.7 PORT-H.1
PH1(TXD2)  (1 unrouted)
  Top 0.3: PORT-H.2 12.4,66.25 38.38,66.25 43.5,61.13 45.48,61.13 46.99,59.62
PH2(XCK2)  (via drill 0.35)  (1 unrouted)
  Top 0.2: 46.42,59.41 U1.14
  Top 0.3: v37.52,67.05 37.5,67.03 10.52,67.03 5.73,62.24 PORT-H.3 | 46.73,59.17 45.27,60.63 43.29,60.63 38.47,65.45 v37.58,65.45
  Bottom 0.3: v37.52,67.05 37.52,65.5 v37.58,65.45
PH3(OC4A)  (via drill 0.35)  (1 unrouted)
  Top 0.3: PORT-H.4 8.9,67.83 35.77,67.83 v35.83,67.88 | 46.23,58.97 45.06,60.13 41.82,60.13 36.48,65.47 35.85,65.47 v35.83,65.45
  Bottom 0.3: v35.83,67.88 v35.83,65.45
PH4(OC4B)  (via drill 0.35)
  Top 0.2: 45.71,58.71 U1.16
  Top 0.3: PORT-H.5 7.16,68.62 v34.45,68.62 | v34.48,65.5 34.67,65.5 40.54,59.63 44.86,59.63 U1.16 45.93,58.56
  Bottom 0.3: v34.48,65.5 34.45,65.53 v34.45,68.62
PH5(OC4C)  (via drill 0.35)
  Top 0.2: U1.17
  Top 0.3: PORT-H.6 6.05,69.42 v32.75,69.42 | U1.17 44.65,59.13 39.72,59.13 33.35,65.5 v32.75,65.5 | U1.17
  Bottom 0.3: v32.75,69.42 v32.75,65.5
PH6(OC2B)  (via drill 0.35)  (1 unrouted)
  Top 0.2: 45.01,58 U1.18
  Top 0.3: PORT-H.7 7.71,70.3 v31.27,70.3 | 44.93,58.15 | 44.93,58.15 44.44,58.63 38.57,58.63 31.7,65.5 v31.3,65.5
  Bottom 0.3: v31.3,65.5 31.3,70.28 v31.27,70.3
PH7(T4)  (via drill 0.35)  (1 unrouted)
  Top 0.2: 42.88,52.34 U1.27
  Top 0.3: v29.98,73.62 29.95,73.65 8.95,73.65 7.75,74.85 5.77,74.85 PORT-H.8 | U1.27 42.32,51.71 41.49,51.71 40.6,52.6 40.6,53.83 29.93,64.5 v29.93,65.5 | U1.27
  Bottom 0.3: v29.98,73.62 29.98,65.55 v29.93,65.5
PJ0(RXD3/PCINT9)  (via drill 0.35)
  Top 0.3: PORT-J.1 8.77,31.18 v8.77,10.61 | v69.3,5.92 77.53,14.15 v77.53,14.4 | U1.63 59.99,46.62 63.39,46.62 v65.53,44.49 | v90.08,29.9 90.08,45.15 v87.15,48.08 | v72.95,47.33 73.62,47.33 76.78,44.17 82.42,44.17 v82.88,43.73
  Bottom 0.3: v8.77,10.61 8.77,8.71 10.34,7.14 22.63,7.14 26.1,3.67 33.38,3.67 34.53,4.82 34.53,5.05 35.18,5.7 44.3,5.7 46.33,3.67 67.04,3.67 v69.3,5.92 | v77.53,14.4 90.08,26.95 v90.08,29.9 | v87.15,48.08 82.88,43.8 v82.88,43.73 | v65.53,44.49 70.11,44.49 v72.95,47.33
PJ1(TXD3/PCINT10)  (via drill 0.35)
  Top 0.3: PORT-J.2 9.55,32.94 v9.55,11.68 | v68.57,6.55 76.5,14.48 v76.5,14.65 | v89,29.9 89,44.98 v85.1,48.88 | v72.95,48.55 73.55,48.55 77.17,44.92 81.1,44.92 v81.15,44.97 | U1.64 60.17,47.15 63.92,47.15 v65.62,45.44
  Bottom 0.3: v9.55,11.68 9.55,9.07 10.99,7.64 22.84,7.64 26.18,4.3 33.08,4.3 34.03,5.25 34.03,7.09 35.26,8.32 45.98,8.32 49.6,4.7 66.72,4.7 v68.57,6.55 | v76.5,14.65 89,27.15 v89,29.9 | v85.1,48.88 81.2,44.97 v81.15,44.97 | v65.62,45.44 69.85,45.44 v72.95,48.55
PJ2(XCK3/PCINT11)  (via drill 0.35)
  Top 0.3: PORT-J.3 10.35,34.67 v10.35,12.65 | v67.82,7.15 v75.47,14.8 | U1.65 60.38,47.65 64.4,47.65 65.65,46.4 v65.7,46.4 | v88.04,29.88 88.04,44.91 v83.45,49.5 | v79.9,46 78.01,46 76.09,47.92 76.09,48.91 75.48,49.52 v72.85,49.52
  Bottom 0.3: v10.35,12.65 10.35,9.75 11.96,8.14 23.05,8.14 26.11,5.08 32.4,5.08 33.53,6.2 33.53,7.3 35.05,8.82 46.18,8.82 49.73,5.28 65.95,5.28 v67.82,7.15 | v88.04,29.88 88.04,27.37 v75.47,14.8 | v65.7,46.4 69.73,46.4 v72.85,49.52 | v83.45,49.5 79.95,46 v79.9,46
PJ3(PCINT12)  (via drill 0.35)
  Top 0.3: PORT-J.4 11.28,36.29 v11.28,13.78 | v67.01,7.69 74.32,15 v74.42,15 | v87.09,29.85 87.09,44.76 v81.7,50.15 | 72.8,50.52 v72.78,50.5 75.27,50.5 76.6,49.17 76.6,48.73 76.59,48.73 76.59,48.12 77.02,47.7 77.93,47.7 v78.6,47.02 | U1.66 60.56,48.17 64.73,48.17 65.52,47.38 v65.7,47.38
  Bottom 0.3: v11.28,13.78 11.28,10.55 12.95,8.88 23.2,8.88 26.23,5.85 30.25,5.85 35.2,10.81 44.91,10.81 49.71,6 65.38,6 67.01,7.63 v67.01,7.69 | v74.42,15 87.09,27.66 v87.09,29.85 | v65.7,47.38 69.66,47.38 v72.78,50.5 | v81.7,50.15 78.6,47.05 v78.6,47.02
PJ4(PCINT13)  (via drill 0.35)
  Top 0.3: PORT-J.5 12.05,38.05 v12.05,14.72 | v66.19,8.23 73.29,15.32 v73.33,15.32 | U1.67 60.76,48.68 65.35,48.68 v65.67,48.36 | v86.12,29.9 86.12,44.7 v79.88,50.95 | v77.32,48.42 77.32,49.27 75.09,51.51 v72.69,51.51
  Bottom 0.3: v12.05,14.72 12.05,11.3 13.82,9.53 23.26,9.53 26.38,6.4 30.07,6.4 31.86,8.18 31.86,15.12 32.7,15.96 36.97,15.96 38.8,14.12 43.49,14.12 44.95,12.67 44.95,11.93 50.02,6.85 64.95,6.85 66.19,8.09 v66.19,8.23 | v73.33,15.32 86.12,28.12 v86.12,29.9 | v65.67,48.36 69.54,48.36 v72.69,51.51 | v79.88,50.95 77.35,48.42 v77.32,48.42
PJ5(PCINT14)  (via drill 0.35)
  Top 0.3: PORT-J.6 12.82,39.82 v12.82,15.95 | v65.31,8.69 72.36,15.75 v72.38,15.75 | U1.68 60.96,49.19 65.55,49.19 v65.7,49.34 | v85.17,29.88 85.17,44.48 77.38,52.27 v77.38,52.58
  Bottom 0.3: v12.82,15.95 12.82,12.3 12.81,12.29 14.82,10.28 25.05,10.28 29.01,14.23 30.24,14.23 32.48,16.48 37.7,16.48 38.83,15.35 43.45,15.35 47.8,19.7 48.4,19.7 49.49,18.62 49.49,8.51 50.3,7.7 64.31,7.7 v65.31,8.69 | v72.38,15.75 85.17,28.54 v85.17,29.88 | v65.7,49.34 69.42,49.34 v72.6,52.52 73.83,53.75 76.2,53.75 v77.38,52.58
PJ6(PCINT15)  (via drill 0.35)
  Top 0.3: v13.57,17 13.57,17.82 13.57,41.61 PORT-J.7 | v64.47,9.28 71.47,16.27 v71.53,16.27 | U1.69 61.15,49.7 63.91,49.7 64.7,50.49 v65.67,50.49 | v84.21,29.85 83.98,30.08 83.98,43.67 74.12,53.52 v72.53,53.52
  Bottom 0.3: v13.57,17 13.57,12.82 15.15,11.25 25.32,11.25 28.8,14.73 30.03,14.73 32.27,16.98 37.91,16.98 38.61,16.27 43.66,16.27 47.59,20.2 48.61,20.2 49.99,18.82 49.99,9.56 51.1,8.45 63.65,8.45 v64.47,9.28 | v71.53,16.27 84.21,28.96 v84.21,29.85 | v65.67,50.49 69.49,50.49 v72.53,53.52
PJ7  (via drill 0.35)
  Top 0.3: PORT-J.8 14.3,43.42 v14.3,18.12 | v63.65,9.9 v70.6,16.85 | U1.79 62.88,58.12 71.12,58.12 75.85,53.4 v75.85,52.85 | v83.26,29.85 83.26,41.27 80.92,43.6 75.62,43.6 73.45,45.77 v73.45,46.27
  Bottom 0.3: v14.3,18.12 14.3,17.3 14.3,13.57 15.82,12.05 23.8,12.05 25.97,14.22 25.97,17.02 26.81,17.87 37.72,17.87 38.31,17.27 43.96,17.27 47.38,20.7 48.82,20.7 50.5,19.02 50.5,10.18 51.48,9.2 62.95,9.2 v63.65,9.9 | v70.6,16.85 83.26,29.51 v83.26,29.85 | v73.45,46.27 75.59,48.42 75.59,49.14 75.85,49.4 v75.85,52.85
PK0(ADC8/PCINT16)  (via drill 0.35)
  Top 0.3: v23.52,44.5 24.8,45.77 24.8,56.95 30.05,62.2 v30.05,63.27 | v52.8,57.43 52.8,57.16 53.23,56.73 54.41,56.73 U1.89
  Bottom 0.3: PORT-K.1 23.52,29.17 v23.52,44.5 | v52.8,57.43 52.5,57.13 50.52,57.13 45.86,61.8 43.6,61.8 42.12,63.27 v30.05,63.27
PK1(ADC9/PCINT17)  (via drill 0.35)  (1 unrouted)
  Top 0.3: v52.35,56.4 52.7,56.05 54.44,56.05 58.3,59.91
  Bottom 0.3: PORT-K.2 21.5,29.68 21.5,56.42 27.6,62.52 42.16,62.52 43.39,61.3 45.6,61.3 50.5,56.4 v52.35,56.4
PK2(ADC10/PCINT18)  (via drill 0.35)  (1 unrouted)
  Top 0.3: v24.93,61.7 v28.2,61.7 | v51.75,55.62 51.97,55.4 54.5,55.4 58.8,59.71
  Bottom 0.3: PORT-K.3 20.38,31.1 20.38,57.15 v24.93,61.7 | v28.2,61.7 42.28,61.7 43.18,60.8 45.35,60.8 50.52,55.62 v51.75,55.62
PK3(ADC11/PCINT19)  (via drill 0.35)
  Top 0.3: v22.77,60.7 27.52,60.7 v27.6,60.78 | v51.95,54.67 v51.96,54.68 54.48,54.68 U1.86
  Bottom 0.3: PORT-K.4 19.3,32.56 19.3,57.23 v22.77,60.7 | v27.6,60.78 42.49,60.78 42.97,60.3 45.14,60.3 50.54,54.89 51.72,54.89 v51.95,54.67
PK4(ADC12/PCINT20)  (via drill 0.35)  (1 unrouted)
  Top 0.3: v26.65,59.97 21.13,59.97 v21.07,60.03 | v51.87,53.69 52.12,53.94 54.45,53.94 59.36,58.85
  Bottom 0.3: v51.87,53.69 51.17,54.39 50.34,54.39 44.94,59.8 42.77,59.8 42.59,59.97 v26.65,59.97 | v21.07,60.03 18.52,57.48 18.52,34.33 8.04,23.84 PORT-K.5
PK5(ADC13/PCINT21)  (via drill 0.35)  (1 unrouted)
  Top 0.3: v50.92,53.6 50.93,53.6 51.57,52.96 52.21,52.96 52.68,53.43 54.65,53.43 59.86,58.65 | v25.93,59.23 19.4,59.23 v19.32,59.3
  Bottom 0.3: v50.92,53.6 50.65,53.87 50.16,53.87 44.8,59.23 v25.93,59.23 | v19.32,59.3 19.32,58.98 18.02,57.69 18.02,36.37 PORT-K.6
PK6(ADC14/PCINT22)  (via drill 0.35)
  Top 0.3: U1.83 54.85,52.92 52.91,52.92 52.45,52.46 51.02,52.46 50.44,53.04 v50.12,53.04 | v25.18,58.48 17.88,58.48 v17.82,58.52
  Bottom 0.3: v50.12,53.04 50.12,53.18 44.8,58.5 26.23,58.5 25.2,58.5 v25.18,58.48 | v17.82,58.52 17.2,57.9 17.2,38.08 5.75,26.62 PORT-K.7
PK7(ADC15/PCINT23)  (via drill 0.35)
  Top 0.3: U1.82 55.06,52.42 53.11,52.42 52.65,51.96 49.78,51.96 v48.96,52.78 | v24.18,57.7 v16.47,57.7
  Bottom 0.3: v48.96,52.78 47.4,54.34 47.4,55.18 44.84,57.74 34.43,57.74 34.42,57.75 25.48,57.75 24.22,57.75 v24.18,57.7 | v16.47,57.7 15.95,57.18 15.95,39.38 PORT-K.8
PL0(ICP4)
  Top 0.2: PORT-L.1 15.15,16.02
  Top 0.3: 15.15,16.02 15.15,38.95 19.8,43.6 42.55,43.6 43.27,44.33 43.27,47.01 U1.35
PL1(ICP5)
  Top 0.2: PORT-L.2 16.3,14.63
  Top 0.3: 16.3,14.63 16.3,38.88 20.52,43.1 43,43.1 43.77,43.88 43.77,46.8 U1.36
PL2(T5)
  Top 0.2: PORT-L.3 17.3,13.09
  Top 0.3: 17.3,13.09 17.3,38.24 21.65,42.6 43.38,42.6 44.33,43.55 44.33,46.64 U1.37
PL3(OC5A)
  Top 0.2: PORT-L.4 18.34,11.59
  Top 0.3: 18.34,11.59 18.34,37.76 22.68,42.1 43.85,42.1 44.85,43.1 44.85,46.46 U1.38
PL4(OC5B)
  Top 0.2: PORT-L.5 19.6,10.32
  Top 0.3: 19.6,10.32 19.6,37.25 23.95,41.6 44.2,41.6 45.38,42.77 45.38,46.28 U1.39
PL5(OC5C)
  Top 0.2: PORT-L.6 20.77,8.94
  Top 0.3: 20.77,8.94 20.77,37.39 24.48,41.1 44.58,41.1 45.92,42.45 45.92,46.12 U1.40
PL6
  Top 0.2: PORT-L.7 21.93,7.57
  Top 0.3: 21.93,7.57 21.93,37.16 25.38,40.6 44.92,40.6 46.48,42.15 46.48,45.97 U1.41
PL7
  Top 0.2: PORT-L.8 22.95,6.04
  Top 0.3: 22.95,6.04 22.95,36.84 26.18,40.08 45.15,40.08 47.03,41.96 47.03,45.81 U1.42 | U1.42
RX  (1 unrouted)
  Top 0.6: U$2.3 50.62,22.25
RX0  (1 unrouted)
  Top 0.6: TXJ.1 53.66,31.27 LED1.C
RX1
  Bottom 0.3: RXE.1 52.63,70.83 57.17,75.38 57.17,77.53 ESP8266.RX
RXC  (via drill 0.35)
  Top 0.3: U1.2 | U1.2 | U1.2 50.1,64.29 50.1,64.8 v51.05,65.75 | TXJ.2 58.5,32.22 59.24,32.22 65.47,25.98 v65.47,25.8 | v82.28,29.8 82.28,38.67 v82.25,38.7 | v90.85,47.38 90.85,60.23 81.28,69.8 81.28,72.15 v78.95,74.47
  Bottom 0.3: TXE.2 49.23,71.58 49.23,67.58 v51.05,65.75 52.05,65.75 53.77,64.03 56.15,64.03 62.02,69.9 66.69,69.9 68.62,71.83 72.08,71.83 PORT-E.8 78.95,78.56 v78.95,74.47 | v82.28,29.8 82.28,29.43 75.88,23.02 70.27,23.02 67.52,25.78 66.44,25.78 66.42,25.8 v65.47,25.8 | v82.25,38.7 90.85,47.3 v90.85,47.38
SCK  (via drill 0.35)  (1 unrouted)
  Top 0.3: PORT-B.7 98.5,35.95 90.4,27.85 78.88,27.85 75.65,31.07 v74.8,31.07 | U1.20 45.8,55.87 45.8,54.65 46.15,54.3 46.45,54.3 v46.67,54.08 | v96.03,14.38 95.92,14.47 v95.92,16.77
  Bottom 0.3: v74.8,31.07 63.7,31.07 45.73,49.05 45.73,53.12 v46.67,54.08 | SPI.7 84.47,7.35 93.4,7.35 96.03,9.97 v96.03,14.38 | PORT-B.7 97.25,36.15 95.92,34.83 v95.92,16.77
TX  (via drill 0.35)
  Top 0.6: U$2.2 49.35,22.75 v49.38,22.77
  Bottom 0.6: v49.38,22.77 52.96,26.36 R3.1
TX0  (1 unrouted)
  Top 0.6: RXJ.1 50.6,30.74 LED2.C
TX1
  Top 0.3: ESP8266.TX 47.81,75.21 49.23,73.79 49.23,72.58 TXE.1
TXC  (via drill 0.35)
  Top 0.3: RXE.2 52.98,75.3 57.92,75.3 59.99,77.36 59.99,79.85 60.64,80.5 72.17,80.5 72.2,80.53 74.44,80.53 PORT-E.7 | U1.3 49.27,64.41 49.27,65.23 51.12,67.08 52.78,67.08 52.93,66.92 53.27,66.92 53.77,67.42 53.77,67.43 56,69.66 60.01,69.66 60.47,69.2 62.21,69.2 64.3,71.29 64.3,71.37 65.62,72.69 66.69,72.69 68.88,74.88 72.59,74.88 PORT-E.7 | RXJ.2 52.26,38.73 54.62,38.73 55.7,37.65 55.7,36.5 64.9,27.3 65.62,27.3 v65.67,27.25 | v81.32,29.77 81.32,38.83 v81.3,38.85 | v78.34,73.74 78.46,73.74 80.47,71.72 80.47,69.4 89.88,60 v89.88,47.5 | v77.25,74.85 76.34,75.76 PORT-E.7
  Bottom 0.3: v65.67,27.25 66.65,26.28 67.73,26.28 70.36,23.65 75.65,23.65 81.32,29.32 v81.32,29.77 | v89.88,47.5 89.88,47.42 v81.3,38.85 | v78.34,73.74 77.25,74.82 v77.25,74.85
XI
  Top 0.6: U$2.7 55.7,19.75 56.42,19.02 61.65,19.02 Y1.2 66.89,19.84 C2.2
XO
  Top 0.6: U$2.8 61.03,24.66 Y1.1 66.97,24.66 C1.2
XTAL1  (via drill 0.35)
  Top 0.2: U1.34
  Top 0.3: v41.32,47.95 41.29,47.95 Y2.2 40.07,46.96 v40.4,46.62 | v41.45,45.52 42.5,46.58 42.5,46.94 U1.34
  Bottom 0.3: C10.2 37.96,49.17 Y2.2 | v40.4,46.62 41.45,45.58 v41.45,45.52
XTAL2  (via drill 0.35)  (1 unrouted)
  Top 0.3: C9.2 39.02,46.58 v39.48,46.12 | 45.22,50.37 40.51,45.66 39.94,45.66 v39.48,46.12 | v39.48,46.12 39.48,48.32 39.06,48.75 39.06,50.18 Y2.1